# Altium schematic sheet Mic_Eingangsstufe.SchDoc: Mic. Eingangsstufe
size A4; Organization: Altium Limited; Address1: L3, 12a Rodborough Rd; Address2: Frenchs Forest; Address3: NSW; Address4: Australia 2086; DocumentNumber: 1; Revision: 2; SheetNumber: 1; SheetTotal: 4
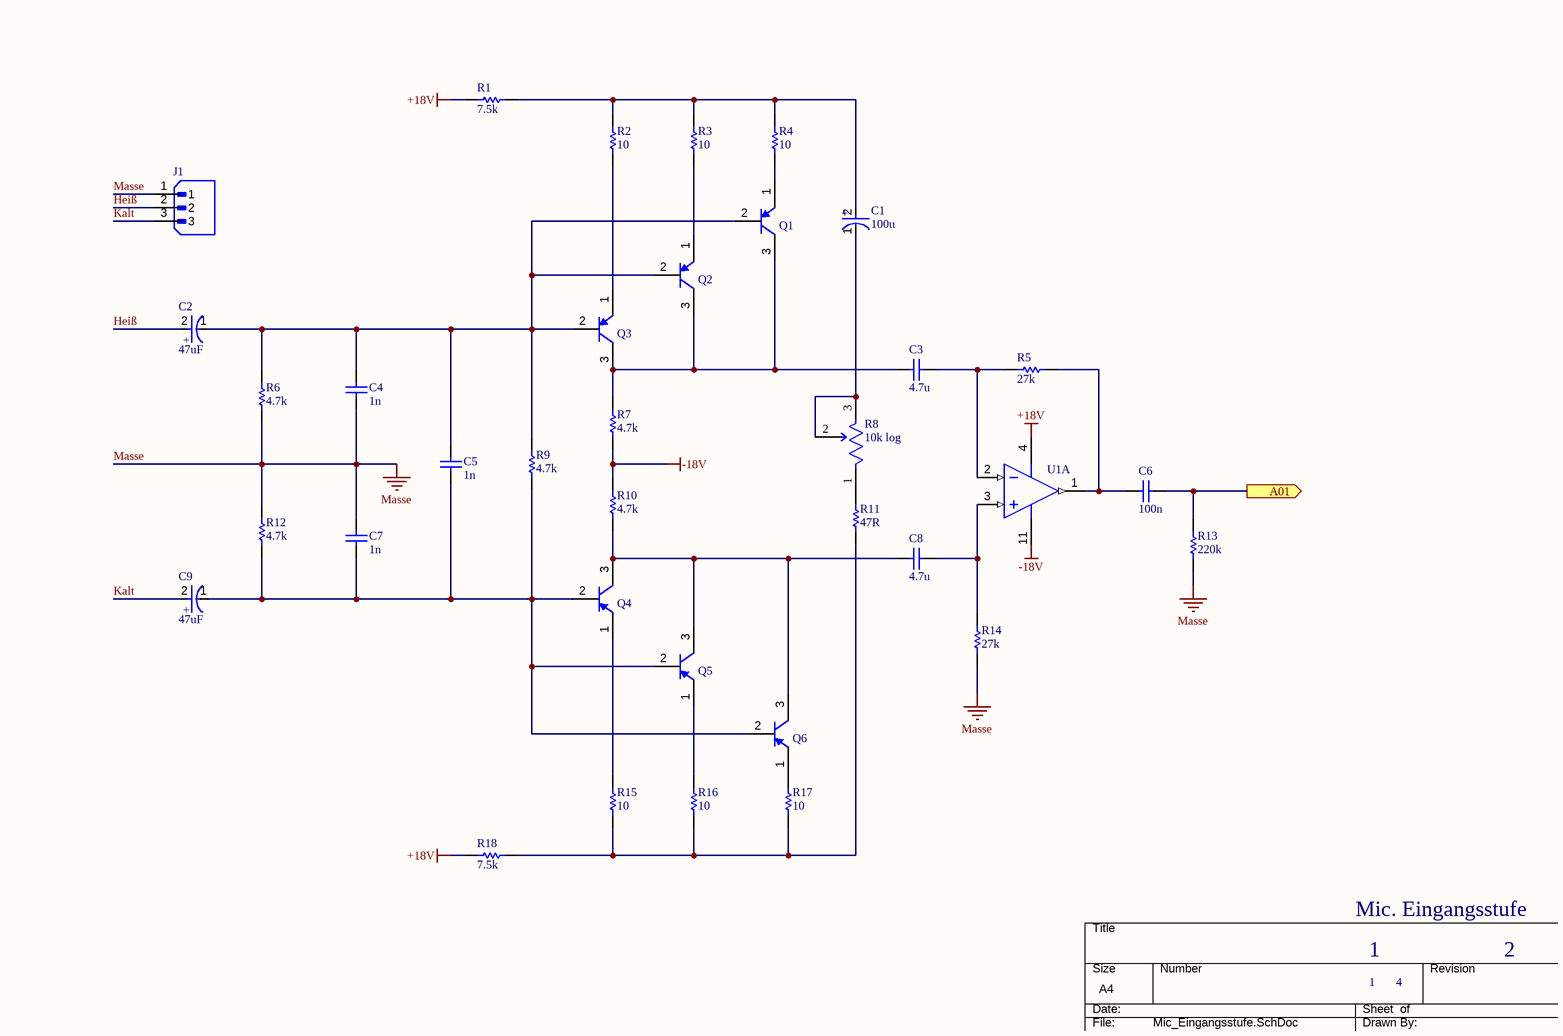
[diagram p0: Mic_Eingangsstufe.SchDoc]

## Parts
C1  100u  [4141 Kondensator]
C2  47uF  [2626 Kondensator]
C3  4.7u  [0805]
C4  1n  [0805]
C5  1n  [0805]
C6  100n  [0805]
C7  1n  [0805]
C8  4.7u  [0805]
C9  47uF  [2626 Kondensator]
J1  Connector x3  [Connector x3]  (value not drawn)
Q1  PNP  [Buchsenleiste 3 Fach PNP TO92]  (value not drawn)
Q2  PNP  [Buchsenleiste 3 Fach PNP TO92]  (value not drawn)
Q3  PNP  [Buchsenleiste 3 Fach PNP TO92]  (value not drawn)
Q4  PNP  [Buchsenleiste 3 Fach PNP TO92]  (value not drawn)
Q5  PNP  [Buchsenleiste 3 Fach PNP TO92]  (value not drawn)
Q6  PNP  [Buchsenleiste 3 Fach PNP TO92]  (value not drawn)
R1  7.5k  [0805]
R2  10  [0805]
R3  10  [0805]
R4  10  [0805]
R5  27k  [0805]
R6  4.7k  [0805]
R7  4.7k  [0805]
R8  10k log  [Connector x3]
R9  4.7k  [0805]
R10  4.7k  [0805]
R11  47R  [0805]
R12  4.7k  [0805]
R13  220k  [0805]
R14  27k  [0805]
R15  10  [0805]
R16  10  [0805]
R17  10  [0805]
R18  7.5k  [0805]
U1  OPA4134UA  [DIP14 IC Socket]  (value not drawn)  (part A of 4)

## Ports
A01 (out)

## Nets
+18V: R1.1 R18.1 U1.4(V+)
-18V: R7.1 R10.2 U1.11(V-)
Masse: C4.1 C7.2 J1.1 R6.1 R12.2 R13.1 R14.1
A01: C6.2 R13.2 ; port A01
Heiß: C2.2(A) J1.2
Kalt: C9.2(A) J1.3
NetC1_1: C1.1(C) R8.2(b) R8.3(c)
NetC1_2: C1.2(A) R1.2 R2.1 R3.1 R4.1
NetC2_1: C2.1(C) C4.2 C5.2 Q1.2(B) Q2.2(B) Q3.2(B) R6.2 R9.2
NetC3_1: C3.1 R5.2 U1.2(IN_A-)
NetC3_2: C3.2 Q1.3(C) Q2.3(C) Q3.3(C) R7.2
NetC5_1: C5.1 C7.1 C9.1(C) Q4.2(B) Q5.2(B) Q6.2(B) R9.1 R12.1
NetC6_1: C6.1 R5.1 U1.1(OUT_A)
NetC8_1: C8.1 R14.2 U1.3(IN_A+)
NetC8_2: C8.2 Q4.3(C) Q5.3(C) Q6.3(C) R10.1
NetQ1_1: Q1.1(E) R4.2
NetQ2_1: Q2.1(E) R3.2
NetQ3_1: Q3.1(E) R2.2
NetQ4_1: Q4.1(E) R15.2
NetQ5_1: Q5.1(E) R16.2
NetQ6_1: Q6.1(E) R17.2
NetR8_1: R8.1(a) R11.2
NetR11_1: R11.1 R15.1 R16.1 R17.1 R18.2

## Notes on the sheet
- THIS DOCUMENT AND THE DATA DISCLOSED HEREIN OR
- HEREWITH IS THE PROPERTY OF ALTIUM LIMITED AND MAY
- DWG NO:
- REVISION
- REV:
- DESCRIPTION
- DATE
- APPROVED
- BE FREELY DISTRIBUTED IN WHOLE. NO RIGHTS ARE
- RESERVED OR EXPRESS OR IMPLIED WARANTEE GIVEN.
- ENG:
- APPROVALS
- PROJECT
- DSN:
- CHK:
- REFERENCE DOCUMENTS
- PROJECT REVISION:
- TITLE
- DOCUMENT REVISION:
- DESIGN ITEM:
- BOM:
- FAB DWG:
- PCB DWG:
- ASSY DWG:
- SCALE:
- A3
- SIZE
- CAGE CODE
- FILE NAME
- DWG NO.
- SHEET
- OF
- REV
- (in symbol 2626 Kondensator) +
- (in symbol 4141 Kondensator) +

## Library data of the parts
C1 = 4141 Kondensator: 4141Kondensator; Value: 100u
C2 C9 = 2626 Kondensator: 2626 Kondensator d=6.6mm; Ripple Current: 2.8A; Voltage: 25V; Polarity: Polar; Leakage Current: 235uA; Tolerance: 20%; Dissipation Factor: 12%; ESR (Equivalent Series Resistance): 30mR; Life (Hours): 5000Hour; Diameter: 6.3mm; Package Quantity: 1000; Packaging: Tape and Reel; Height - Seated (Max): 0.236inch; Case/Package: Radial; Termination: SMD/SMT; Series: OS-CON™, SVPF; Number of Pins: 6; Value: 47uF; Min Operating Temperature: -55°C; Mount: Surface Mount; RoHS Compliant: Yes; Voltage Rating (DC): 25V; Length: 5.9mm; REACH SVHC: No SVHC; Voltage Rating: 25V; Ripple Current (AC): 2.8A; Height: 5.9mm; Max Operating Temperature: 105°C
C3-C8 = 0805 Kondensator
  C3 C8: Value: 4.7u
  C4 C5 C7: Value: 1n
  C6: Value: 100n
J1 = Connector x3: Connector Header Through Hole 3 position 0.100 (2.54mm); MF: JST Sales; MP: B3B-XH-A; SnapEDA_Link: https://www.snapeda.com/parts/B3B-XH-A/JST+Sales+America+Inc./view-part/?ref=snap; Package: None; Value: *; Check_prices: https://www.snapeda.com/parts/B3B-XH-A/JST+Sales+America+Inc./view-part/?ref=eda
Q1-Q6 = TO-92 PNP BUchsenleiste: TO-92 PNP Bipolar Transistor; Typ: PNP
R1-R7 R9-R18 = 0805 Widerstand
  R1 R18: Value: 7.5k
  R2-R4 R15-R17: Value: 10
  R5 R14: Value: 27k
  R6 R7 R9 R10 R12: Value: 4.7k
  R11: Value: 47R
  R13: Value: 220k
R8 = Potentiometer Buchsenleiste: Potentiometer; Value: 10k log
U1 = SOIC OPA4134UA: SoundPlus(TM) High Performance Audio Operational Amplifier, 5 to 36 V, -55 to 125 degC, 14-pin SOIC (D14), Green (RoHS & no Sb/Br); Manufacturer: Texas Instruments; Vmax(V): 36; Number of Channels: 4; Iq per channel(Max)(mA): 5; GBW(Typ)(MHz): 8; DatasheetVersion: SBOS058; ComponentLink2URL: http://www.ti.com/general/docs/lit/getliterature.tsp?genericPartNumber=OPA4134&fileType=pdf; ComponentLink1URL: http://www.ti.com/; PackageDescription: 14-Pin Plastic Small Outline, Body 8.65 x 3.9 mm, Pitch 1.27 mm; SubFamily: Audio Operational Amplifier; Vmin(V): 5; ComponentLink2Description: Datasheet; PackageVersion: 4040047-5/M, 06/2011; Code_JEDEC: MS-012; PackageReference: D0014A; ComponentLink1Description: Manufacturer URL; Vn at Flatband(Typ)(nV/rtHz): 8; Eco-Plan: Green (RoHS & no Sb/Br); Mounting Technology: Surface Mount; ComponentLink3URL: http://www.ti.com/lit/ml/mpds177g/mpds177g.pdf; PartNumber: OPA4134UA; ComponentLink3Description: Package Specification